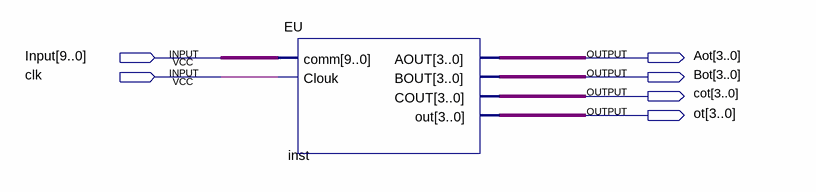
[diagram p0: schematic sheet]
// Quartus schematic ExecutionUnit.bdf as structural Verilog: 1 symbols, 6 pins
module ExecutionUnit (
  input  [9:0] Input,
  input  clk,
  output [3:0] Aot,
  output [3:0] Bot,
  output [3:0] cot,
  output [3:0] ot
);

  EU inst (.comm(Input), .Clouk(clk), .AOUT(Aot), .BOUT(Bot), .COUT(cot), .out(ot));
endmodule
